# EAGLE design PCB (EAGLE 9.2.2)

## Sheet 1 of 2
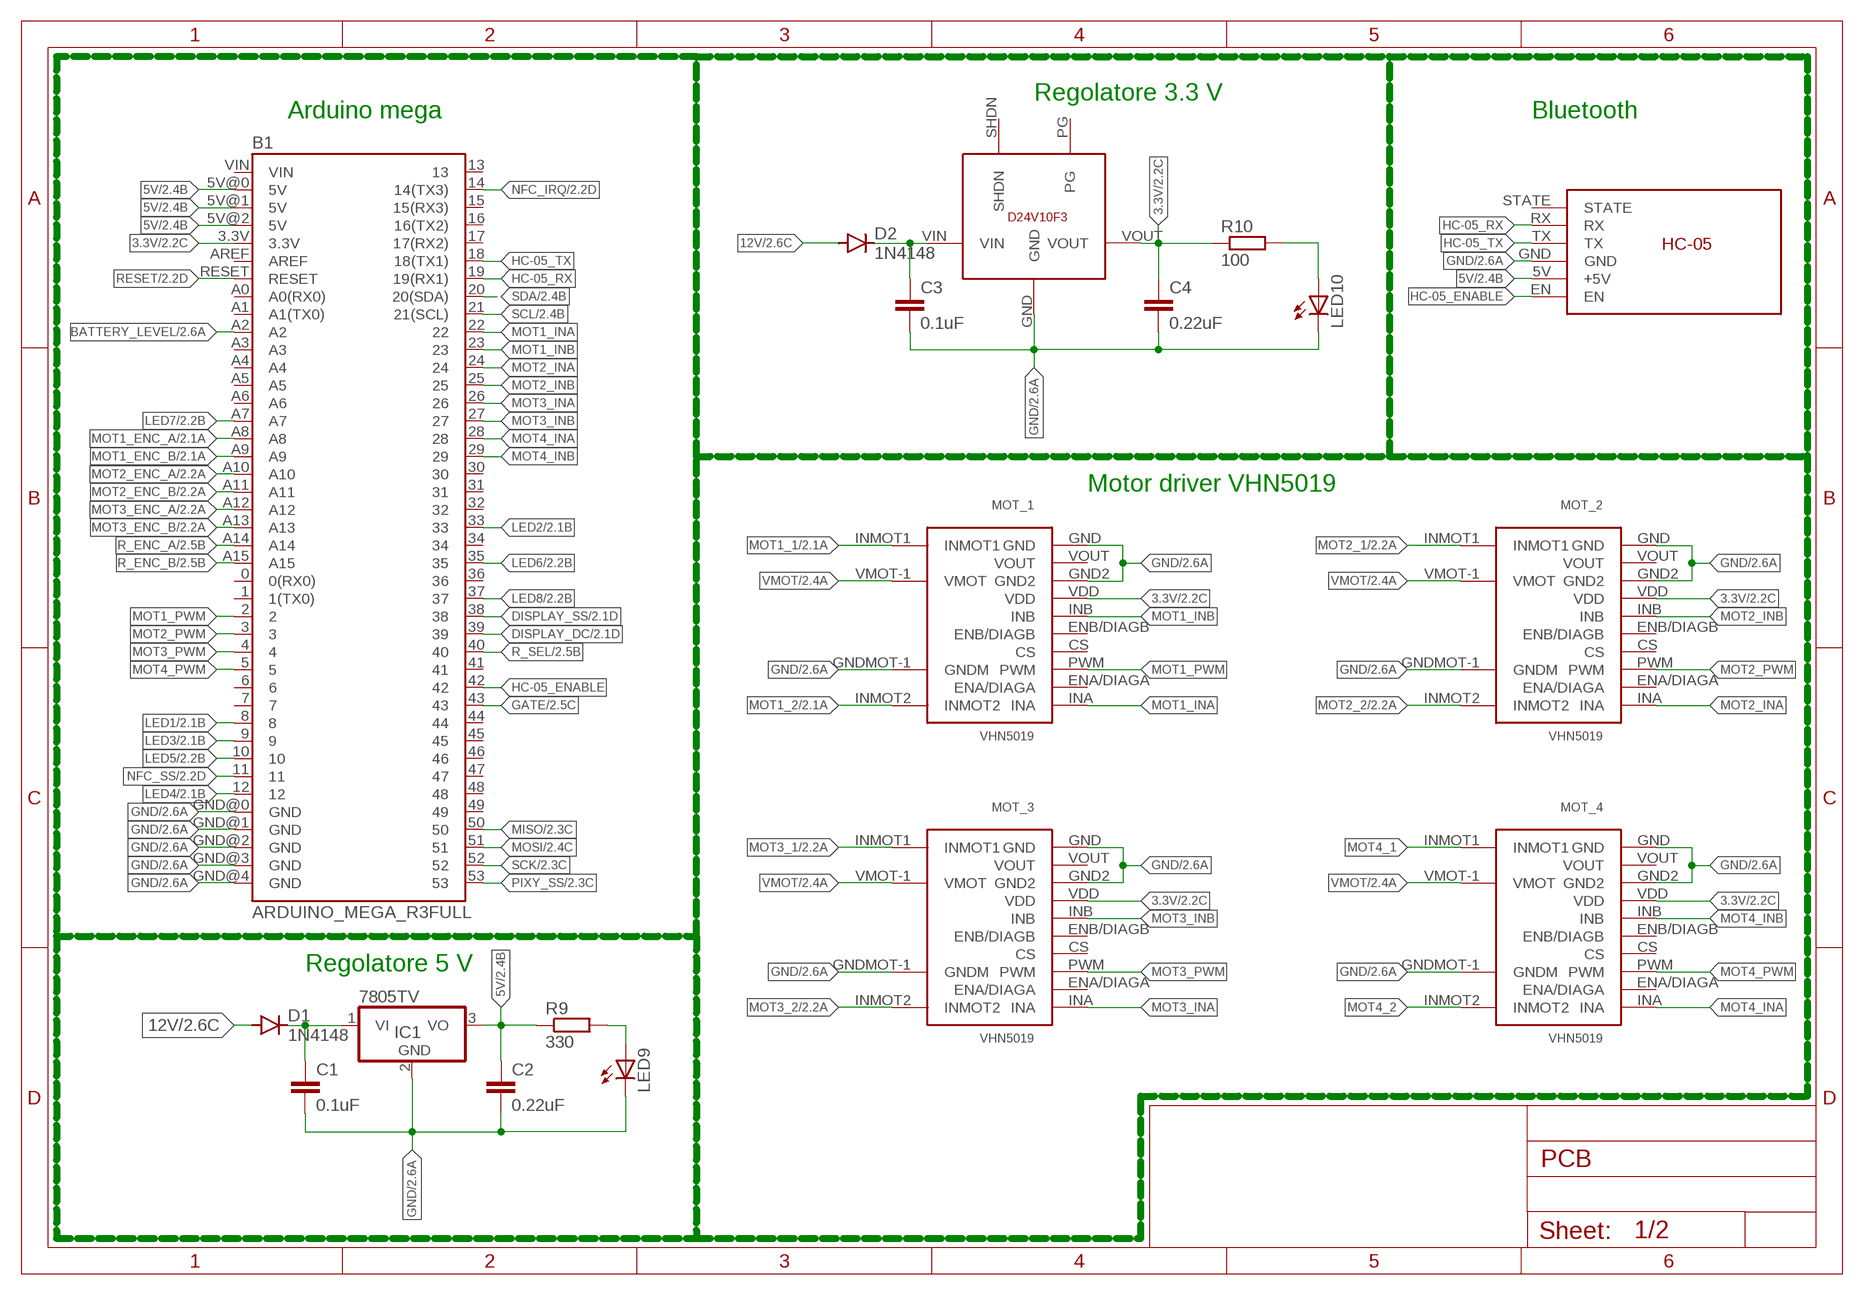
[diagram p0: schematic, sheet 1]

### Parts
B1  ARDUINO_MEGA_R3FULL  [ARDUINO_MEGA]
C1  0.1uF  0.1UF-KIT-EZ-50V-20%  [CAP-PTH-SMALL-KIT]
C2  0.22uF  0.1UF-KIT-EZ-50V-20%  [CAP-PTH-SMALL-KIT]
C3  0.1uF  0.1UF-KIT-EZ-50V-20%  [CAP-PTH-SMALL-KIT]
C4  0.22uF  0.1UF-KIT-EZ-50V-20%  [CAP-PTH-SMALL-KIT]
D1  1N4148  1N4942  [DO41-10]
D2  1N4148  1N4942  [DO41-10]
IC1  7805TV  [TO220V]
LED9  LED1206  [LED-1206]
LED10  LED1206  [LED-1206]
MOT_1  VHN5019  [MOTOR-SHIELD]
MOT_2  VHN5019  [MOTOR-SHIELD]
MOT_3  VHN5019  [MOTOR-SHIELD]
MOT_4  VHN5019  [MOTOR-SHIELD]
R9  330  RR1206  [R1206]
R10  100  RR1206  [R1206]
U$1  STEPDOWN_D24V10F3  [STEPDOWN_D24V10F3]
U$9  HC-05  [HC-05]

### Nets
3.3V: B1.3.3V C4.1 MOT_1.VDD MOT_2.VDD MOT_3.VDD MOT_4.VDD R10.1 U$1.VOUT ; also sheet 2
5V: B1.5V@0(5V) B1.5V@1(5V) B1.5V@2(5V) C2.1 IC1.3(VO) R9.1 U$9.5V(+5V) ; also sheet 2
12V: D1.A D2.A ; also sheet 2
BATTERY_LEVEL: B1.A2 ; also sheet 2
DISPLAY_DC: B1.39 ; also sheet 2
DISPLAY_SS: B1.38 ; also sheet 2
GATE: B1.43 ; also sheet 2
GND: B1.GND@0(GND) B1.GND@1(GND) B1.GND@2(GND) B1.GND@3(GND) B1.GND@4(GND) C1.2 C2.2 C3.2 C4.2 IC1.2(GND) LED9.C LED10.C MOT_1.GND MOT_1.GND2 MOT_1.GNDMOT-1(GNDM) MOT_2.GND MOT_2.GND2 MOT_2.GNDMOT-1(GNDM) MOT_3.GND MOT_3.GND2 MOT_3.GNDMOT-1(GNDM) MOT_4.GND MOT_4.GND2 MOT_4.GNDMOT-1(GNDM) U$1.GND U$9.GND ; also sheet 2
HC-05_ENABLE: B1.42 U$9.EN
HC-05_RX: B1.19(19(RX1)) U$9.RX
HC-05_TX: B1.18(18(TX1)) U$9.TX
LED1: B1.8 ; also sheet 2
LED2: B1.33 ; also sheet 2
LED3: B1.9 ; also sheet 2
LED4: B1.12 ; also sheet 2
LED5: B1.10 ; also sheet 2
LED6: B1.35 ; also sheet 2
LED7: B1.A7 ; also sheet 2
LED8: B1.37 ; also sheet 2
MISO: B1.50 ; also sheet 2
MOSI: B1.51 ; also sheet 2
MOT1_1: MOT_1.INMOT1 ; also sheet 2
MOT1_2: MOT_1.INMOT2 ; also sheet 2
MOT1_ENC_A: B1.A8 ; also sheet 2
MOT1_ENC_B: B1.A9 ; also sheet 2
MOT1_INA: B1.22 MOT_1.INA
MOT1_INB: B1.23 MOT_1.INB
MOT1_PWM: B1.2 MOT_1.PWM
MOT2_1: MOT_2.INMOT1 ; also sheet 2
MOT2_2: MOT_2.INMOT2 ; also sheet 2
MOT2_ENC_A: B1.A10 ; also sheet 2
MOT2_ENC_B: B1.A11 ; also sheet 2
MOT2_INA: B1.24 MOT_2.INA
MOT2_INB: B1.25 MOT_2.INB
MOT2_PWM: B1.3 MOT_2.PWM
MOT3_1: MOT_3.INMOT1 ; also sheet 2
MOT3_2: MOT_3.INMOT2 ; also sheet 2
MOT3_ENC_A: B1.A12 ; also sheet 2
MOT3_ENC_B: B1.A13 ; also sheet 2
MOT3_INA: B1.26 MOT_3.INA
MOT3_INB: B1.27 MOT_3.INB
MOT3_PWM: B1.4 MOT_3.PWM
MOT4_1: MOT_4.INMOT1
MOT4_2: MOT_4.INMOT2
MOT4_INA: B1.28 MOT_4.INA
MOT4_INB: B1.29 MOT_4.INB
MOT4_PWM: B1.5 MOT_4.PWM
N$3: LED9.A R9.2
N$4: C3.1 D2.C U$1.VIN
N$6: LED10.A R10.2
N$8: C1.1 D1.C IC1.1(VI)
NFC_IRQ: B1.14(14(TX3)) ; also sheet 2
NFC_SS: B1.11 ; also sheet 2
PIXY_SS: B1.53 ; also sheet 2
R_ENC_A: B1.A14 ; also sheet 2
R_ENC_B: B1.A15 ; also sheet 2
R_SEL: B1.40 ; also sheet 2
RESET: B1.RESET ; also sheet 2
SCK: B1.52 ; also sheet 2
SCL: B1.21(21(SCL)) ; also sheet 2
SDA: B1.20(20(SDA)) ; also sheet 2
VMOT: MOT_1.VMOT-1(VMOT) MOT_2.VMOT-1(VMOT) MOT_3.VMOT-1(VMOT) MOT_4.VMOT-1(VMOT) ; also sheet 2
Unconnected: B1.0(0(RX0)) B1.1(1(TX0)) B1.6 B1.7 B1.13 B1.15(15(RX3)) B1.16(16(TX2)) B1.17(17(RX2)) B1.30 B1.31 B1.32 B1.34 B1.36 B1.41 B1.44 B1.45 B1.46 B1.47 B1.48 B1.49 B1.A0(A0(RX0)) B1.A1(A1(TX0)) B1.A3 B1.A4 B1.A5 B1.A6 B1.AREF B1.VIN MOT_1.CS MOT_1.ENA/DIAGA MOT_1.ENB/DIAGB MOT_1.VOUT MOT_2.CS MOT_2.ENA/DIAGA MOT_2.ENB/DIAGB MOT_2.VOUT MOT_3.CS MOT_3.ENA/DIAGA MOT_3.ENB/DIAGB MOT_3.VOUT MOT_4.CS MOT_4.ENA/DIAGA MOT_4.ENB/DIAGB MOT_4.VOUT U$1.PG U$1.SHDN U$9.STATE

### Notes on the sheet
- Regolatore 3.3 V
- Arduino mega | Bluetooth
- Motor driver VHN5019
- Regolatore 5 V

## Sheet 2 of 2
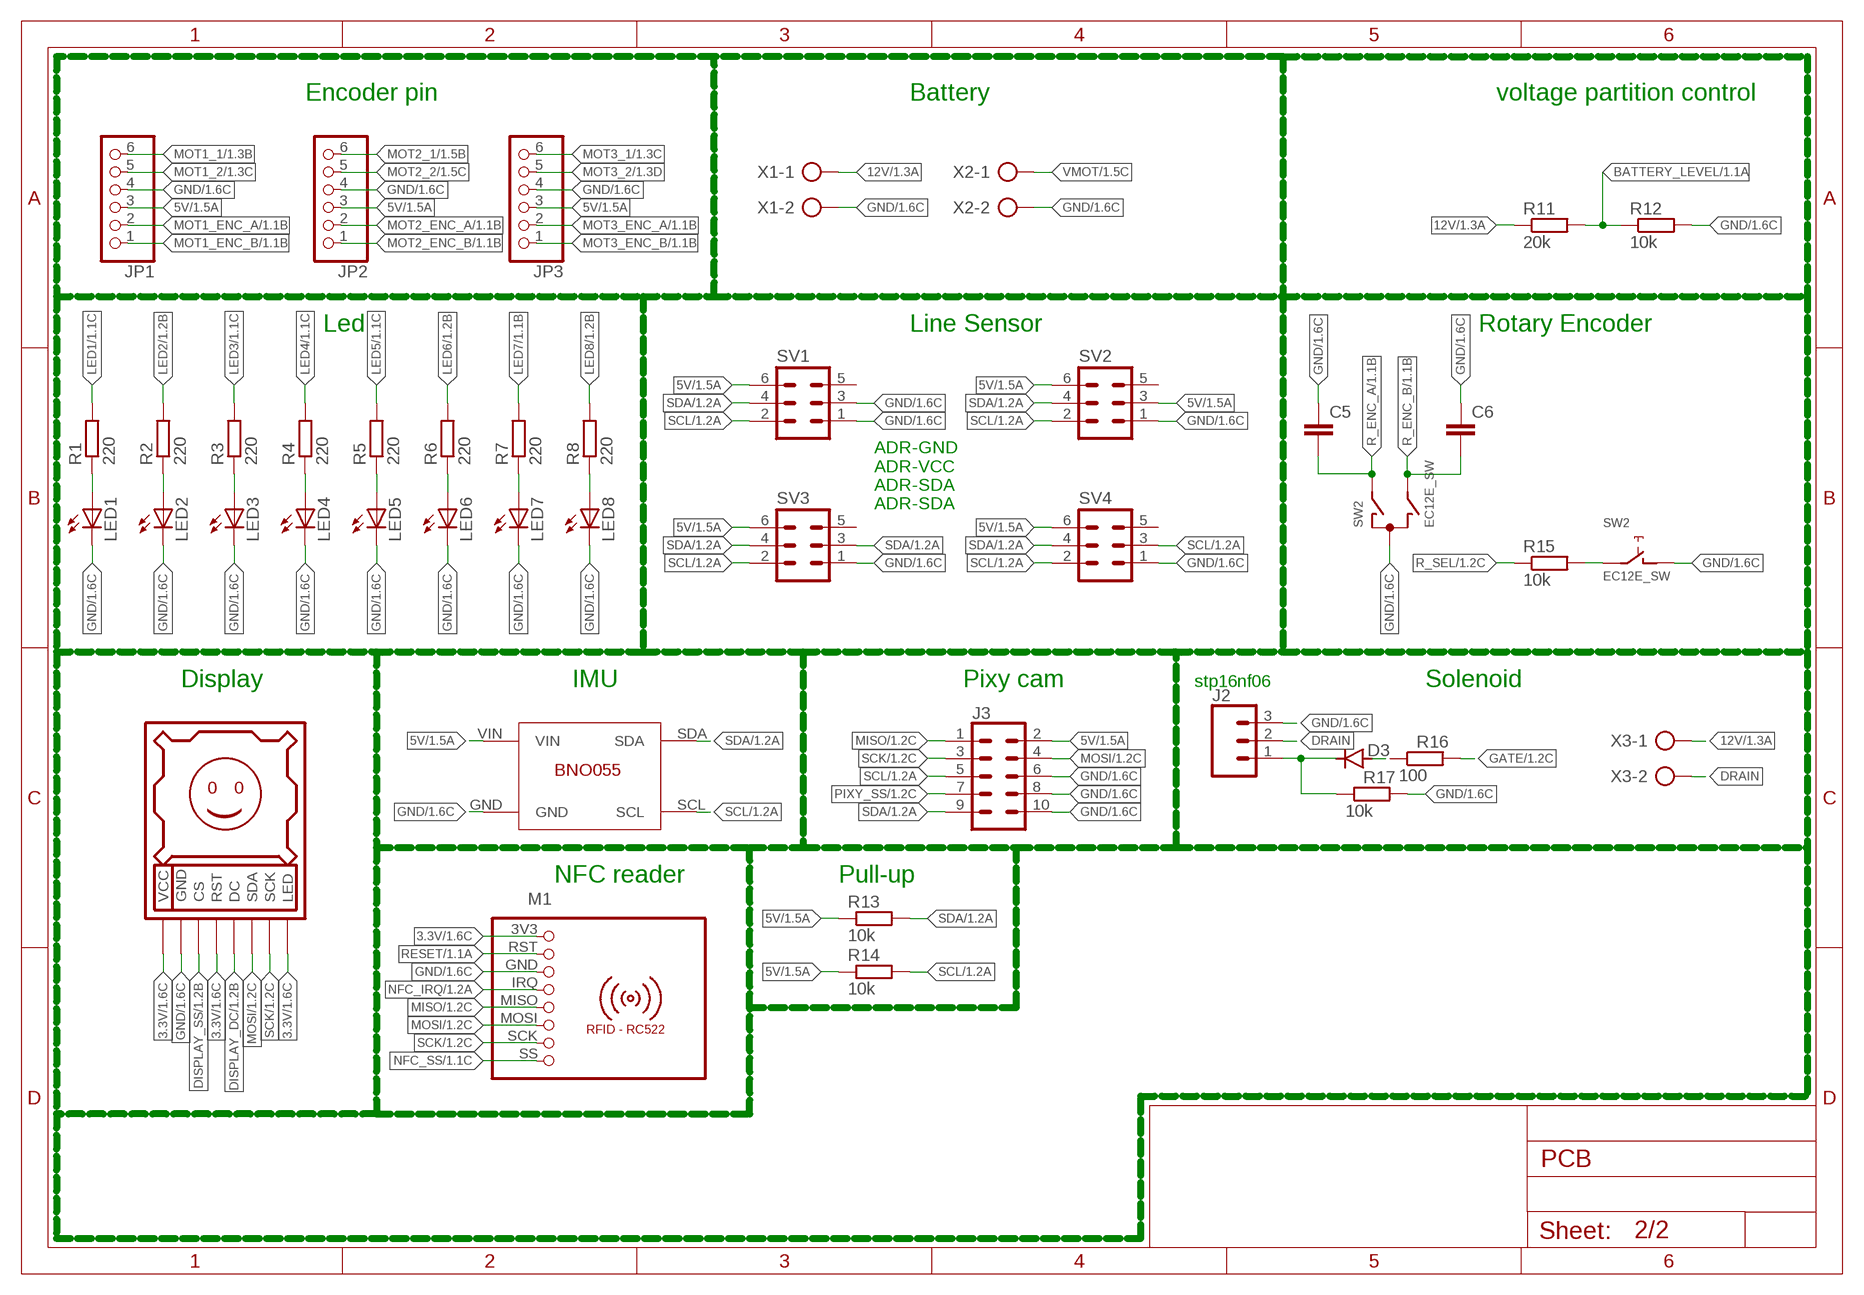
[diagram p1: schematic, sheet 2]

### Parts
C5  C-EUC1206  [C1206]
C6  C-EUC1206  [C1206]
D3  1N4148  1N4148DO35-7  [DO35-7]
DISPLAY1  DISPLAY128X128  [DISPLAY128X128]
J2  455-1750-1-ND  CONN_03  [1X03]
J3  CONN_05X2PTH  [2X5]
JP1  PINHD-1X6  [1X06]
JP2  PINHD-1X6  [1X06]
JP3  PINHD-1X6  [1X06]
LED1  LED1206  [LED-1206]
LED2  LED1206  [LED-1206]
LED3  LED1206  [LED-1206]
LED4  LED1206  [LED-1206]
LED5  LED1206  [LED-1206]
LED6  LED1206  [LED-1206]
LED7  LED1206  [LED-1206]
LED8  LED1206  [LED-1206]
M1  RFID-RC522  [RFID-RC522]
R1  220  RR1206  [R1206]
R2  220  RR1206  [R1206]
R3  220  RR1206  [R1206]
R4  220  RR1206  [R1206]
R5  220  RR1206  [R1206]
R6  220  RR1206  [R1206]
R7  220  RR1206  [R1206]
R8  220  RR1206  [R1206]
R11  20k  R0204/7  [0204/7]
R12  10k  R0204/7  [0204/7]
R13  10k  RR1206  [R1206]
R14  10k  RR1206  [R1206]
R15  10k  RR1206  [R1206]
R16  100  RR1206  [R1206]
R17  10k  RR1206  [R1206]
SV1  MA03-2  [MA03-2]
SV2  MA03-2  [MA03-2]
SV3  MA03-2  [MA03-2]
SV4  MA03-2  [MA03-2]
SW2  EC12E_SW  [ALPS_EC12E_SW]
U$8  BNO055  [BNO005]
X1  AK500/2-H  [AK500/2-H]
X2  AK500/2-H  [AK500/2-H]
X3  AK500/2-H  [AK500/2-H]

### Nets
3.3V: DISPLAY1.LED DISPLAY1.RST DISPLAY1.VCC M1.3V3 ; also sheet 1
5V: J3.2 JP1.3 JP2.3 JP3.3 R13.1 R14.1 SV1.6 SV2.3 SV2.6 SV3.6 SV4.6 U$8.VIN ; also sheet 1
12V: R11.1 X1.1 X3.1 ; also sheet 1
BATTERY_LEVEL: R11.2 R12.1 ; also sheet 1
DISPLAY_DC: DISPLAY1.DC ; also sheet 1
DISPLAY_SS: DISPLAY1.CS ; also sheet 1
DRAIN: J2.2 X3.2
GATE: R16.2 ; also sheet 1
GND: C5.1 C6.1 DISPLAY1.GND J2.3 J3.6 J3.8 J3.10 JP1.4 JP2.4 JP3.4 LED1.C LED2.C LED3.C LED4.C LED5.C LED6.C LED7.C LED8.C M1.GND R12.2 R17.2 SV1.1 SV1.3 SV2.1 SV3.1 SV4.1 SW2.C SW2.D U$8.GND X1.2 X2.2 ; also sheet 1
LED1: R1.2 ; also sheet 1
LED2: R2.2 ; also sheet 1
LED3: R3.2 ; also sheet 1
LED4: R4.2 ; also sheet 1
LED5: R5.2 ; also sheet 1
LED6: R6.2 ; also sheet 1
LED7: R7.2 ; also sheet 1
LED8: R8.2 ; also sheet 1
MISO: J3.1 M1.MISO ; also sheet 1
MOSI: DISPLAY1.SDA J3.4 M1.MOSI ; also sheet 1
MOT1_1: JP1.6 ; also sheet 1
MOT1_2: JP1.5 ; also sheet 1
MOT1_ENC_A: JP1.2 ; also sheet 1
MOT1_ENC_B: JP1.1 ; also sheet 1
MOT2_1: JP2.6 ; also sheet 1
MOT2_2: JP2.5 ; also sheet 1
MOT2_ENC_A: JP2.2 ; also sheet 1
MOT2_ENC_B: JP2.1 ; also sheet 1
MOT3_1: JP3.6 ; also sheet 1
MOT3_2: JP3.5 ; also sheet 1
MOT3_ENC_A: JP3.2 ; also sheet 1
MOT3_ENC_B: JP3.1 ; also sheet 1
N$5: D3.C J2.1 R17.1
N$7: D3.A R16.1
N$10: LED1.A R1.1
N$12: LED2.A R2.1
N$13: LED3.A R3.1
N$14: LED4.A R4.1
N$17: LED5.A R5.1
N$18: LED6.A R6.1
N$23: LED7.A R7.1
N$24: LED8.A R8.1
N$25: R15.2 SW2.E
NFC_IRQ: M1.IRQ ; also sheet 1
NFC_SS: M1.SS ; also sheet 1
PIXY_SS: J3.7 ; also sheet 1
R_ENC_A: C5.2 SW2.A ; also sheet 1
R_ENC_B: C6.2 SW2.B ; also sheet 1
R_SEL: R15.1 ; also sheet 1
RESET: M1.RST ; also sheet 1
SCK: DISPLAY1.SCK J3.3 M1.SCK ; also sheet 1
SCL: J3.5 R14.2 SV1.2 SV2.2 SV3.2 SV4.2 SV4.3 U$8.SCL ; also sheet 1
SDA: J3.9 R13.2 SV1.4 SV2.4 SV3.3 SV3.4 SV4.4 U$8.SDA ; also sheet 1
VMOT: X2.1 ; also sheet 1
Unconnected: SV1.5 SV2.5 SV3.5 SV4.5 SW2.GND1(G) SW2.GND2(G)

### Notes on the sheet
- Encoder pin | Battery | voltage partition control
- Led | Line Sensor | Rotary Encoder
- ADR-GND
  ADR-VCC
  ADR-SDA
  ADR-SDA
- Display | IMU | Pixy cam | stp16nf06 | Solenoid
- NFC reader | Pull-up

## Library data of the parts
B1 = SparkFun-Boards:ARDUINO_MEGA_R3: Arduino Mega R3 ATmega2560 R3 compatible footprint. SparkFun Products: Arduino Mega 2560 R3 <https://www.sparkfun.com/products/11061>
C1 C3 = SparkFun-Capacitors:0.1UF: 0.1µF ceramic capacitors A capacitor is a passive two-terminal electrical component used to store electrical energy temporarily in an electric field.; PROD_ID: CAP-08370
C2 C4 = SparkFun-Capacitors:0.1UF: 0.1µF ceramic capacitors A capacitor is a passive two-terminal electrical component used to store electrical energy temporarily in an electric field.; PROD_ID: CAP-08370; VALUE: 0.1uF
C5 C6 = rcl:C-EU: CAPACITOR, European symbol; SPICEPREFIX: C
D1 D2 = diode:1N4942: DIODE 1.0 A, 200 V, 150 ns
D3 = diode:1N4148: DIODE high speed (Philips)
DISPLAY1 = Display 128x128:DISPLAY128X128: LCD 1.44" Red Serial 128X128 SPI Color TFT LCD Display Module for Nokia 15XX Product information Description： 100% brand new and high quality 1.44-inch screen with SPI serial backplane module, a minimum of only four IO-driven resolution 128 * 128 Spike NOKIA 15XX, perfect upgrade true color Size: 1.44 inch SPI serial bus Resolution 128 * 128 Package Include:
IC1 = linear:78*: Positive VOLTAGE REGULATOR Source: http://cache.national.com/ds/LM/LM78L05.pdf http://www.fairchildsemi.com/ds/LM/LM7805.pdf
J2 = SparkFun-Connectors:CONN_03: Multi connection point. Often used as Generic Header-pin footprint for 0.1 inch spaced/style header connections On any of the 0.1 inch spaced packages, you can populate with these: Break Away Headers - Straight <https://www.sparkfun.com/products/116> (PRT-00116) Break Away Male Headers - Right Angle <https://www.sparkfun.com/products/553> (PRT-00553) Female Headers <https://www.sparkfun.com/products/115> (PRT-00115) Break Away Headers - Machine Pin <https://www.sparkfun.com/products/117> (PRT-00117) Break Away Female Headers - Swiss Machine Pin <https://www.sparkfun.com/products/743> (PRT-00743) Stackable Header - 3 Pin (Female, 0.1") <https://www.sparkfun.com/products/13875> (PRT-13875) For SCREWTERMINALS and SPRING TERMINALS visit here: Screw Terimnals on SparkFun.com <https://www.sparkfun.com/search/results?term=Screw+Terminals> (5mm/3.5mm/2.54mm spacing) This device is also useful as a general connection point to wire up your design to another part of your project. Our various solder wires solder well into these plated through hole pads. Hook-Up Wire - Assortment (Stranded, 22 AWG) <https://www.sparkfun.com/products/11375> (PRT-11375) Hook-Up Wire - Assortment (Solid Core, 22 AWG) <https://www.sparkfun.com/products/11367> (PRT-11367) View the entire wire category on our website here <https://www.sparkfun.com/categories/141> Special notes: Molex polarized connector foot print use with SKU : PRT-08232 with associated crimp pins and housings.; PROD_ID: XXX-00000
J3 = SparkFun-Connectors:CONN_05X2: Multi connection point. Often used as Generic Header-pin footprint for 0.1 inch spaced/style header connections For AVR SPI programming port, see special device with nice symbol: "AVR_SPI_PROG_5x2.dev" You can populate with any combo of single row headers, but if you'd like an exact match, check these: 2x5 AVR ICSP Male Header <https://www.sparkfun.com/products/778> (PRT-00778) 2x5 Pin Shrouded Header <https://www.sparkfun.com/products/8506> (PRT-08506) On any of the 0.1 inch spaced packages, you can populate with these: Break Away Headers - Straight <https://www.sparkfun.com/products/116> (PRT-00116) Break Away Male Headers - Right Angle <https://www.sparkfun.com/products/553> (PRT-00553) Female Headers <https://www.sparkfun.com/products/115> (PRT-00115) Break Away Headers - Machine Pin <https://www.sparkfun.com/products/117> (PRT-00117) Break Away Female Headers - Swiss Machine Pin <https://www.sparkfun.com/products/743> (PRT-00743) Special note: the shrouded connector mates well with our 5x2 ribbon cables: 2x5 Pin IDC Ribbon Cable <https://www.sparkfun.com/products/8535> (PRT-08535); PROD_ID: CONN-08499; SF_ID: PRT-0778
JP1-JP3 = pinhead:PINHD-1X6: PIN HEADER
LED1-LED10 = SparkFun-Retired:LED: LEDs Standard schematic elements and footprints for 5mm, 3mm, 1206, and 0603 sized LEDs. 5mm - Spark Fun Electronics SKU : Comp-SBL
M1 = mfrc522-module:RFID-RC522: RFID-RC522 MFRC-522 based breakout board
MOT_1-MOT_4 = VHN5019:VHN5019: Operating voltage: 5.5 – 24 V1 Output current: 12 A continuous (30 maximum) 3V-compatible inputs PWM operation up to 20 kHz, which is ultrasonic and allows for quieter motor operation Current sense output proportional to motor current (approx. 140 mV/A) Motor indicator LEDs (indicates what the outputs are doing even when no motor is connected) Robust: Reverse-voltage protection Can survive input voltages up to 41 V Undervoltage and overvoltage shutdown High-side and low-side thermal shutdown Short-to-ground and short-to-Vcc protection; MOTOR: motor
R1-R17 = eagle-ltspice:R: RESISTOR, European symbol; SPICEMODEL: NONE; SPICEPREFIX: R
SV1-SV4 = con-lstb:MA03-2: PIN HEADER; OC_FARNELL: unknown; OC_NEWARK: unknown
SW2 = switch-alps:EC12E_SW: ALPS rotary Encoder EC12E series with switch; MPN: EC12E2424407; OC_FARNELL: 1520813; OC_NEWARK: 74M1068
U$1 = StepDown_ 3.3V_D24V10F3:STEPDOWN_D24V10F3: Step down pololu D24V10F3 da 12 V a 3.3V
U$8 = BNO055:BNO055: BNO055
U$9 = HC-05:HC-05
X1-X3 = con-ptr500:AK500/2-H: CONNECTOR Aug. 2004 / PTR Meßtechnik: Die Bezeichnung der Serie AK505 wurde geändert. Es handelt sich hierbei um AK500 in horizontaler Ausführung.; OC_FARNELL: unknown; OC_NEWARK: unknown

## Board
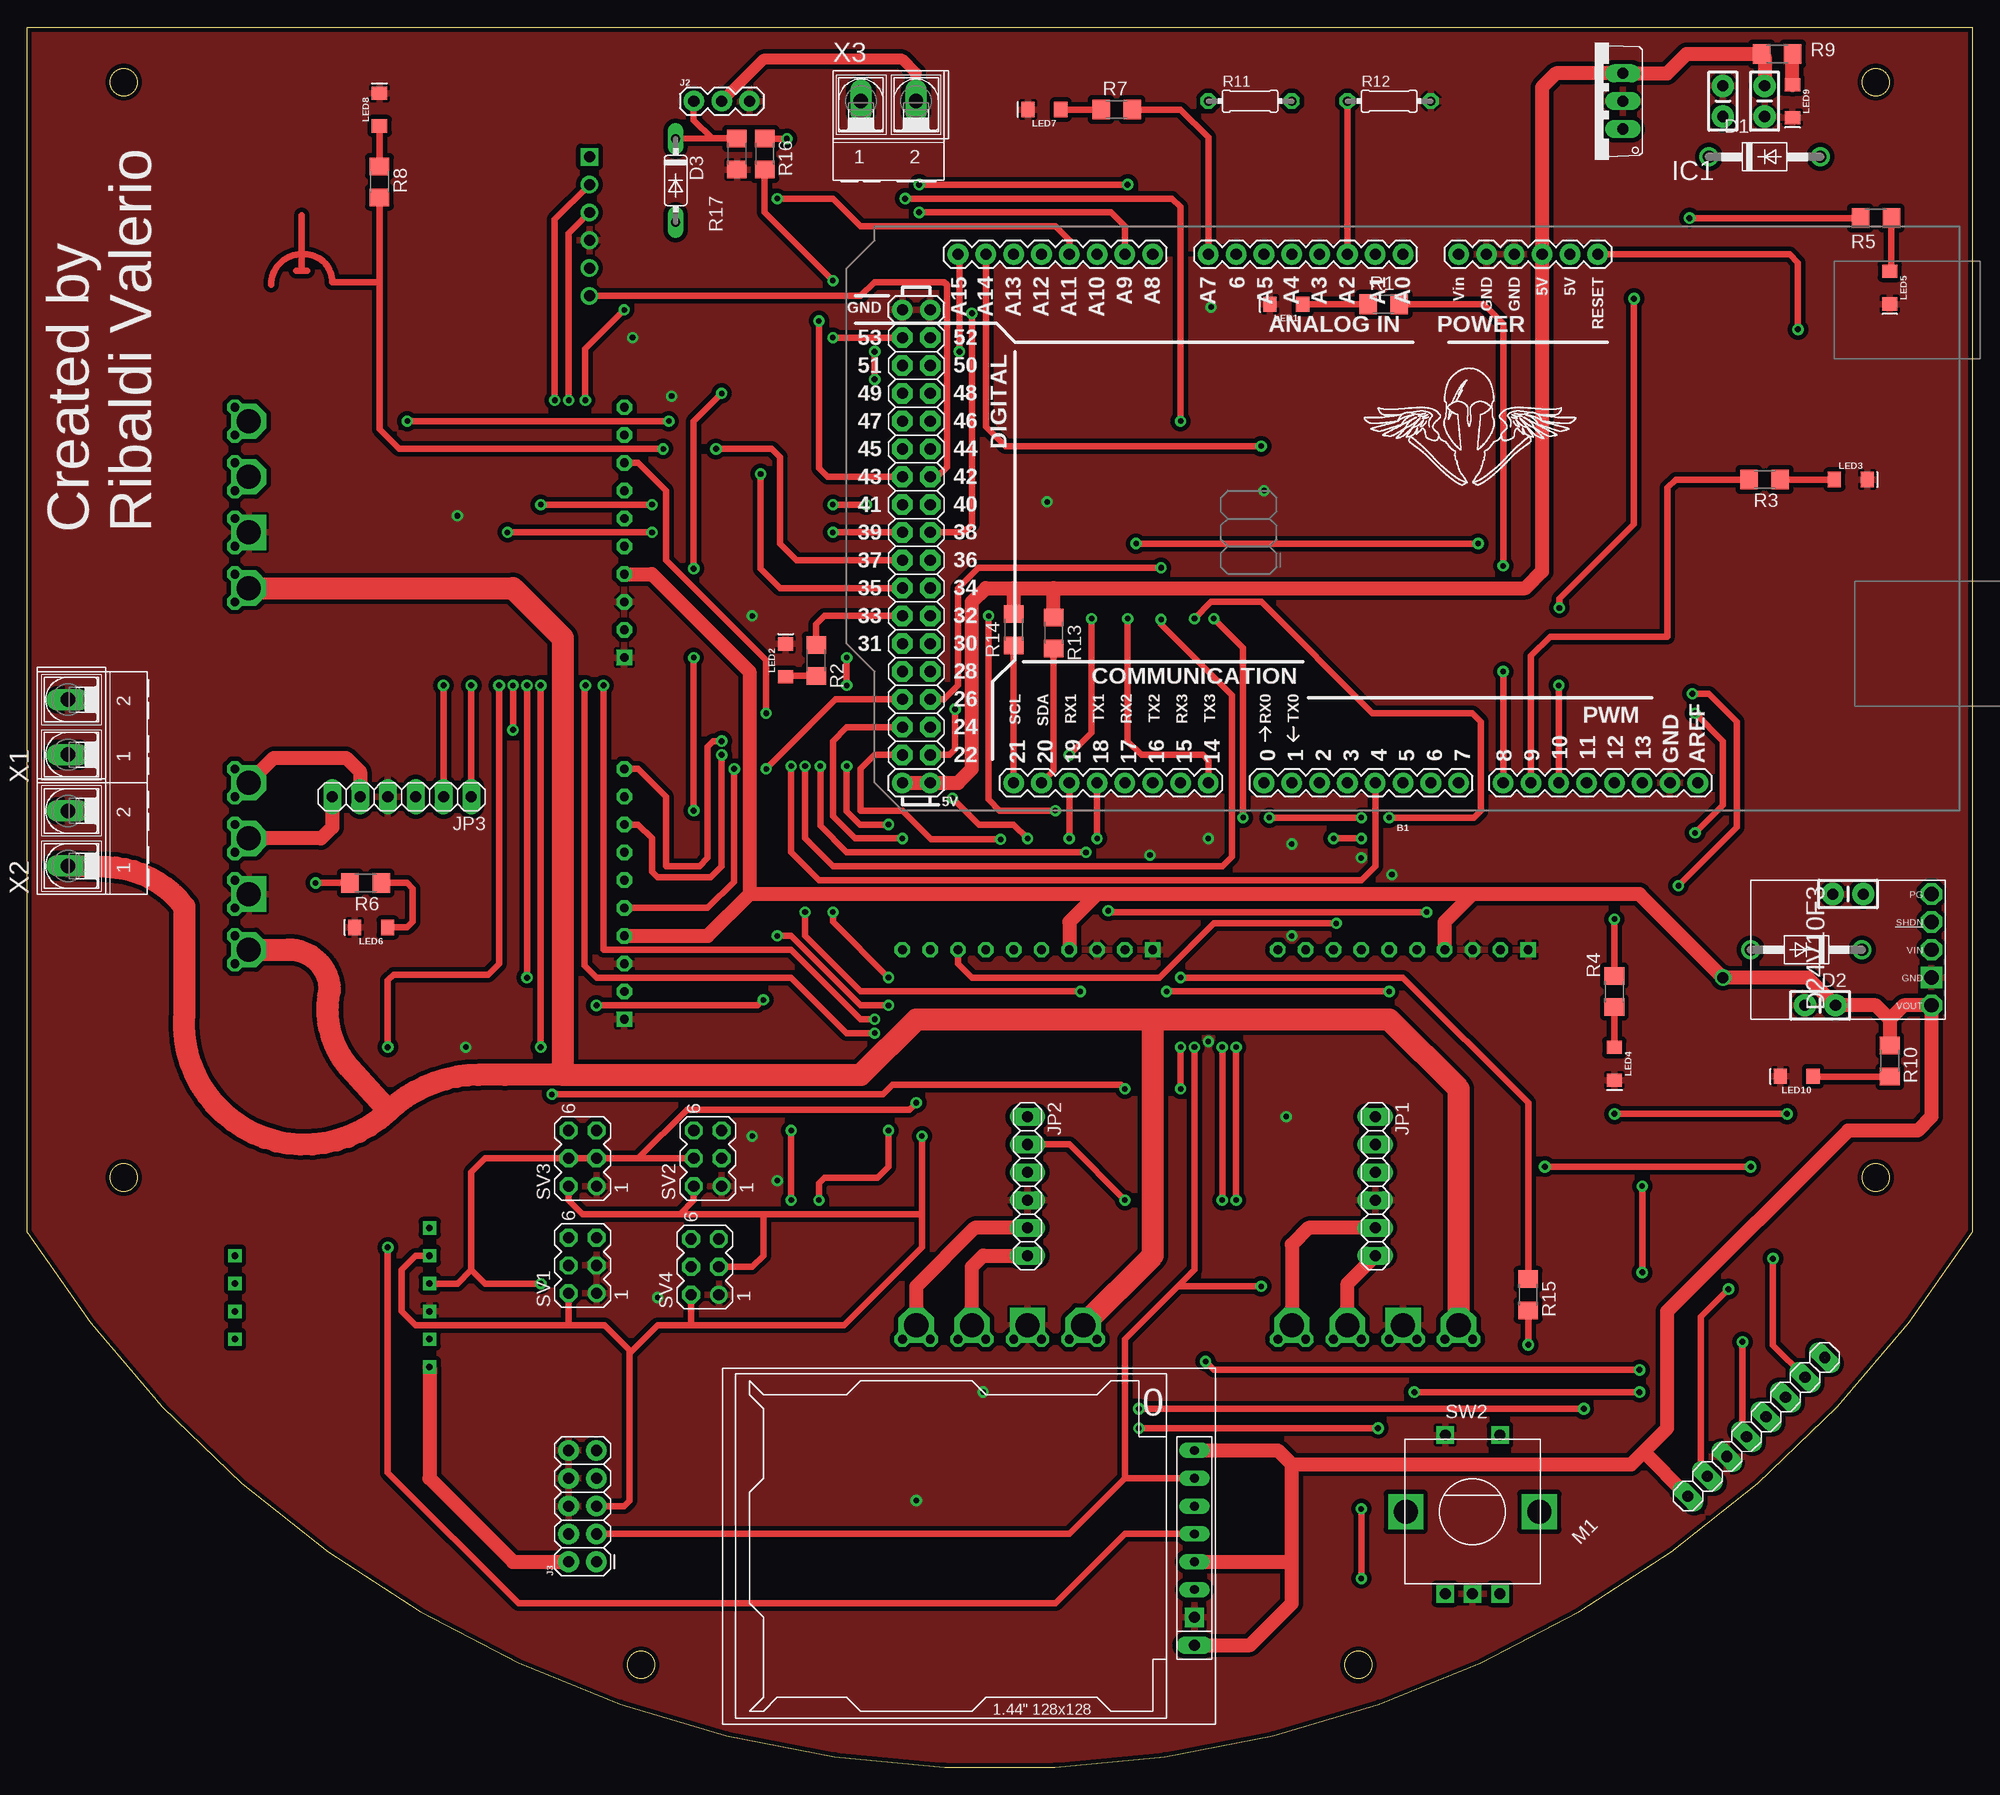
[diagram p2: board, top side]
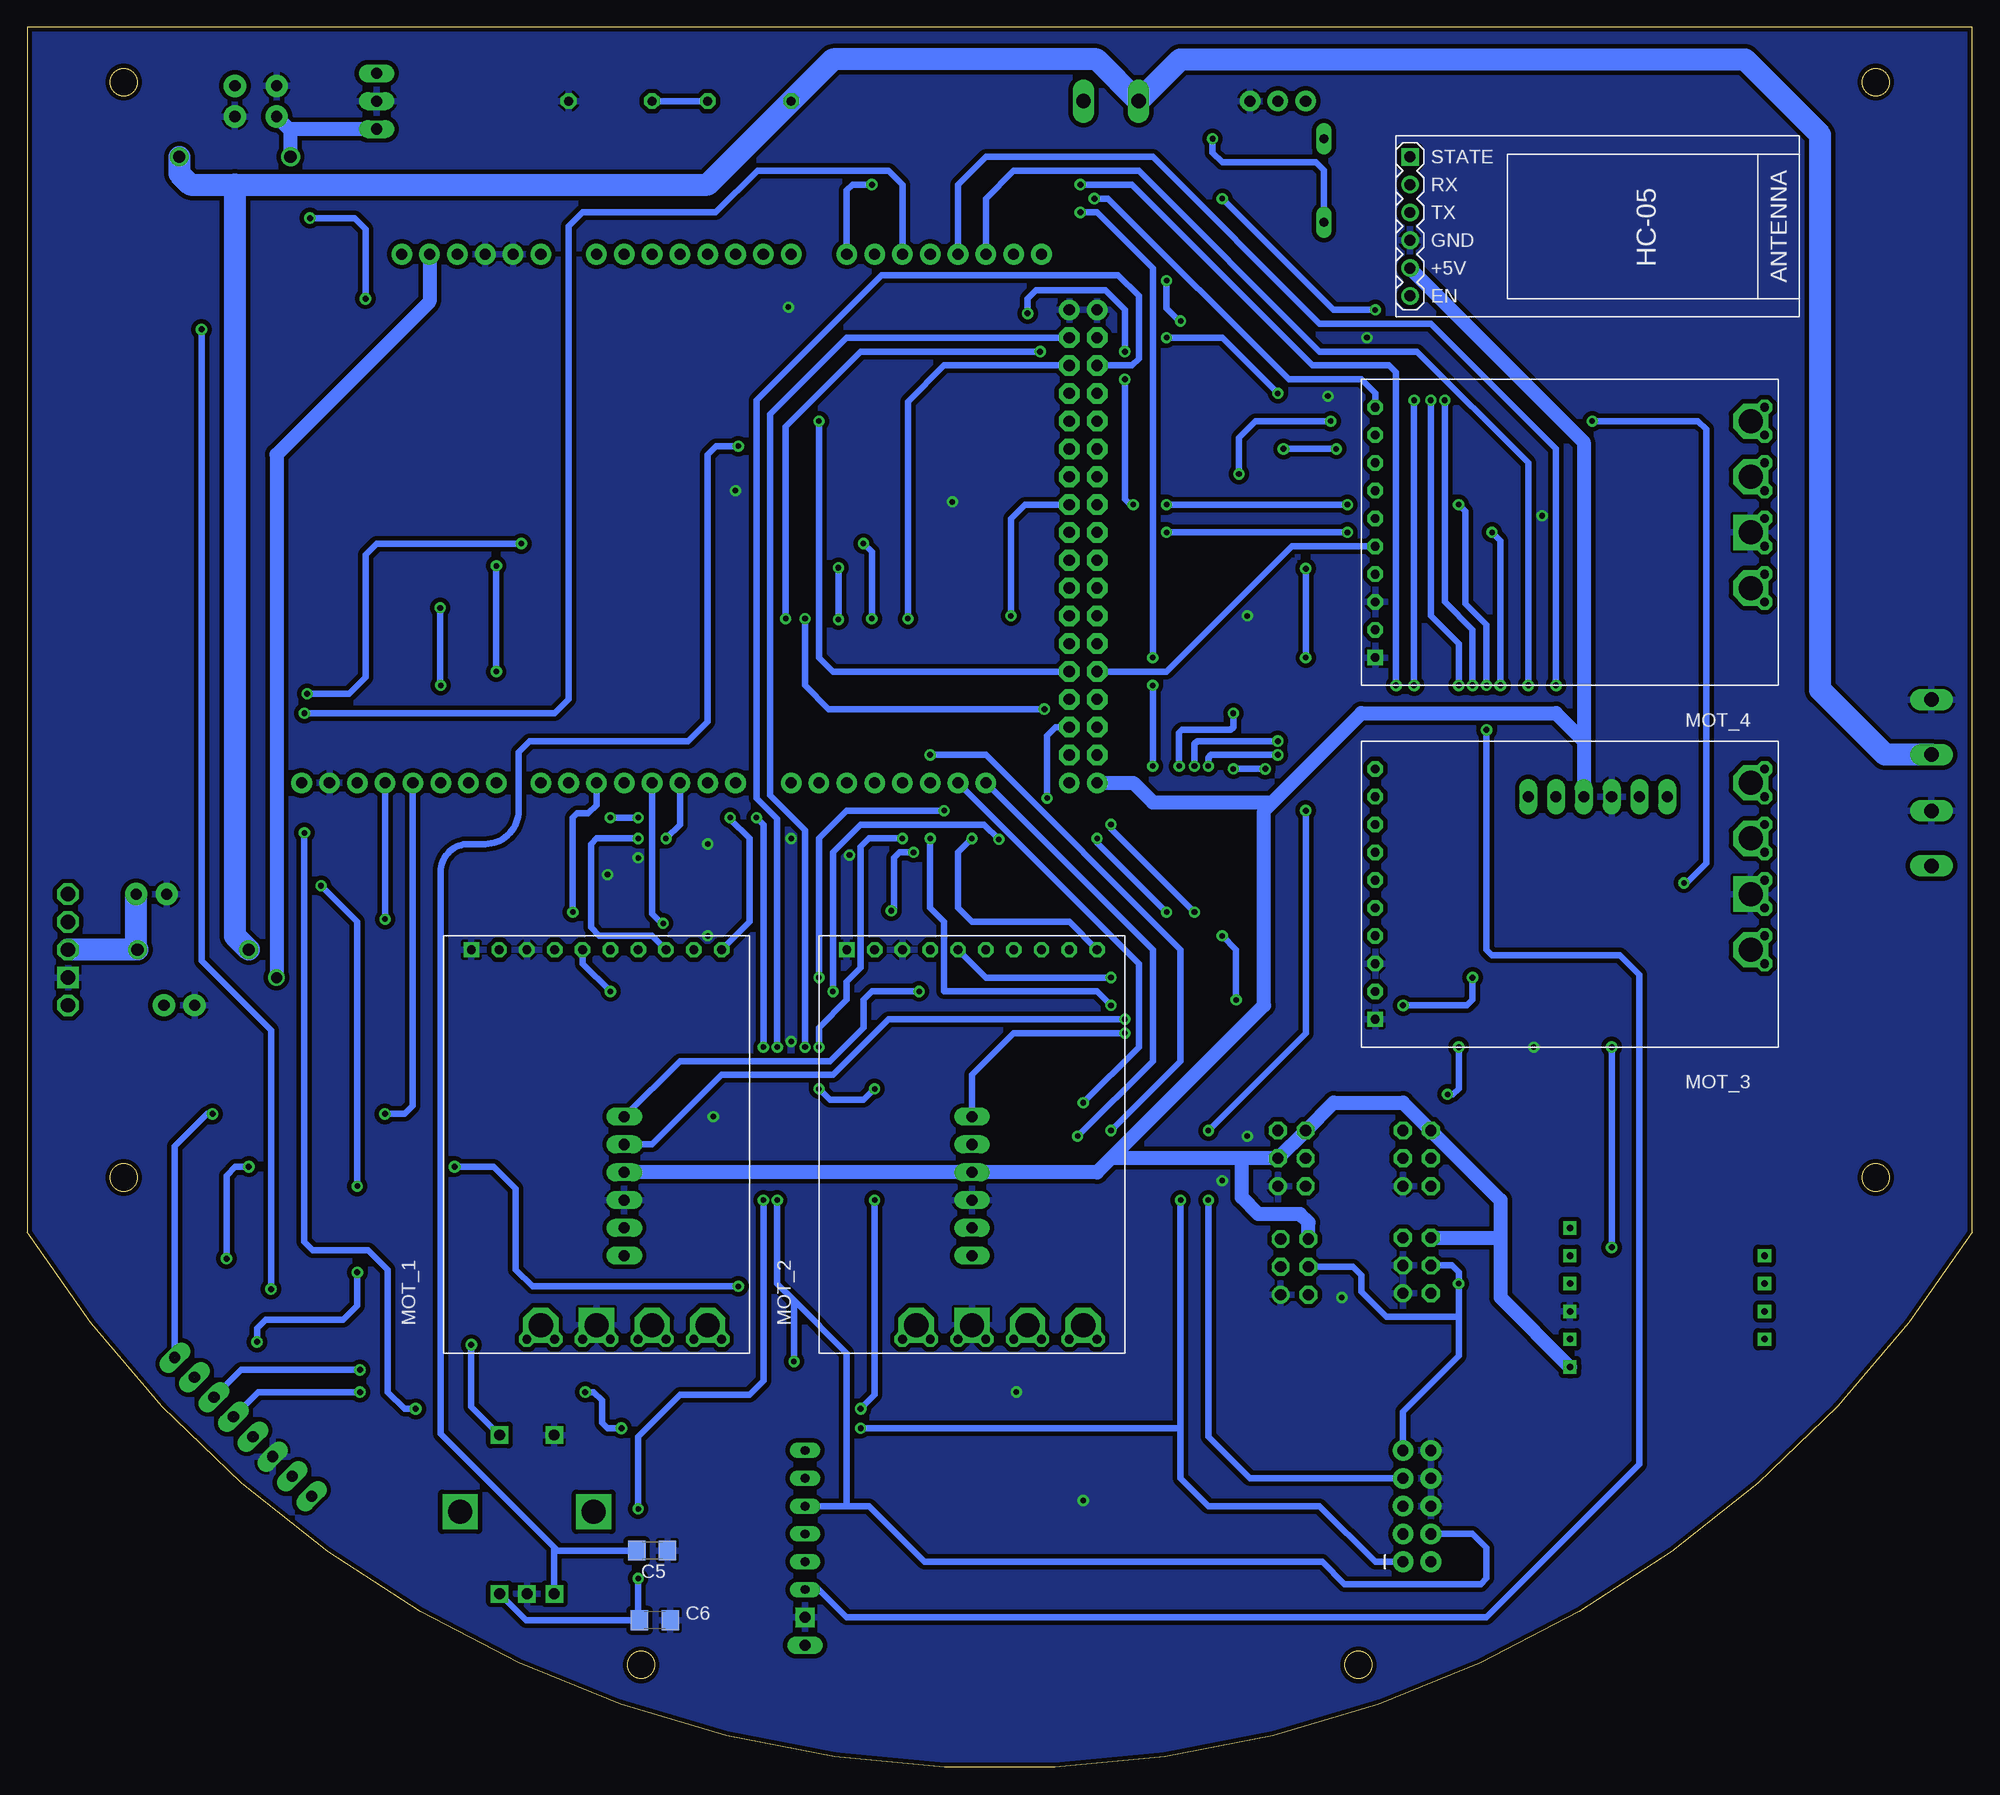
[diagram p3: board, bottom side, seen from below]

Size 177.6 x 158.85 mm. Coordinates in mm from the lower left corner, seen from the top.
Outline: 0,158.85 177.6,158.85 177.6,48.85 arc-115 0,48.85 0,158.85
Outline: circle at 8.8,53.85 radius 1.25
Outline: circle at 168.8,53.85 radius 1.25
Outline: circle at 168.8,153.85 radius 1.25
Outline: circle at 8.8,153.85 radius 1.25
Outline: circle at 121.56,9.34 radius 1.25
Outline: circle at 56.04,9.34 radius 1.25
Copper layers (1*16): Top 0.035mm / dielectric 1.5mm / Bottom 0.035mm
Design rules "SparkFun": minimum track width 8mil, minimum drill 20mil, track to track 8mil, track to pad 8mil, pad to pad 8mil, via to via 8mil, smd to smd 8mil, copper to edge 10mil, drill to drill 8mil, minimum pad ring 12mil, minimum via ring 10mil, stop-mask expansion 4mil, vias tented up to drill 25mil, thermal gap 10mil

### Footprints (pad centres in the part's own frame; a part is rotated, then mirrored left to right if it is on the bottom)
ARDUINO_MEGA = drill 1.016 pad 1.88: 0 13.97,24.13; 1 11.43,24.13; 2 8.89,24.13; 3 6.35,24.13; 3.3V -13.97,-24.13; 4 3.81,24.13; 5 1.27,24.13; 5V@0 -11.43,-24.13; 5V@1 44.45,24.13; 5V@2 46.99,24.13; 6 -1.27,24.13; 7 -3.81,24.13; 8 -7.874,24.13; 9 -10.414,24.13; 10 -12.954,24.13; 11 -15.494,24.13; 12 -18.034,24.13; 13 -20.574,24.13; 14 19.05,24.13; 15 21.59,24.13; 16 24.13,24.13; 17 26.67,24.13; 18 29.21,24.13; 19 31.75,24.13; 20 34.29,24.13; 21 36.83,24.13; A0 1.27,-24.13; A1 3.81,-24.13; A2 6.35,-24.13; A3 8.89,-24.13; A4 11.43,-24.13; A5 13.97,-24.13; A6 16.51,-24.13; A7 19.05,-24.13; A8 24.13,-24.13; A9 26.67,-24.13; A10 29.21,-24.13; A11 31.75,-24.13; A12 34.29,-24.13; A13 36.83,-24.13; A14 39.37,-24.13; A15 41.91,-24.13; AREF -25.654,24.13; GND@0 -8.89,-24.13; GND@1 -6.35,-24.13; GND@2 44.45,-19.05; GND@3 46.99,-19.05; GND@4 -23.114,24.13; RESET -16.51,-24.13; VIN -3.81,-24.13 | drill 1.016 pad 1.88 octagon: 22 44.45,21.59; 23 46.99,21.59; 24 44.45,19.05; 25 46.99,19.05; 26 44.45,16.51; 27 46.99,16.51; 28 44.45,13.97; 29 46.99,13.97; 30 44.45,11.43; 31 46.99,11.43; 32 44.45,8.89; 33 46.99,8.89; 34 44.45,6.35; 35 46.99,6.35; 36 44.45,3.81; 37 46.99,3.81; 38 44.45,1.27; 39 46.99,1.27; 40 44.45,-1.27; 41 46.99,-1.27; 42 44.45,-3.81; 43 46.99,-3.81; 44 44.45,-6.35; 45 46.99,-6.35; 46 44.45,-8.89; 47 46.99,-8.89; 48 44.45,-11.43; 49 46.99,-11.43; 50 44.45,-13.97; 51 46.99,-13.97; 52 44.45,-16.51; 53 46.99,-16.51
CAP-PTH-SMALL-KIT = drill 1.016 pad 2.032: 1 -1.397,0; 2 1.397,0
C1206 = smd 1.6 x 1.8: 1 -1.4,0; 2 1.4,0
DO41-10 = drill 1.118: A 5.08,0; C -5.08,0
DO35-7 = drill 0.813 long: A 3.81,0; C -3.81,0
DISPLAY128X128 = drill 0.8 long: CS 20.32,-5.08; DC 20.32,0; LED 20.32,7.62; RST 20.32,-2.54; SCK 20.32,5.08; SDA 20.32,2.54 | drill 1 pad 1.778 square: GND 20.32,-7.62 | drill 1 long: VCC 20.32,-10.16
TO220V = drill 1.016 long: 1 -2.54,-2.54; 2 0,-2.54; 3 2.54,-2.54
1X03 = drill 1.016 pad 1.88: 1 0,0; 2 2.54,0; 3 5.08,0
2X5 = drill 1.016 pad 1.88: 1 0,0; 2 0,2.54; 3 2.54,0; 4 2.54,2.54; 5 5.08,0; 6 5.08,2.54; 7 7.62,0; 8 7.62,2.54; 9 10.16,0; 10 10.16,2.54
1X06 = drill 1.016 long: 1 -6.35,0; 2 -3.81,0; 3 -1.27,0; 4 1.27,0; 5 3.81,0; 6 6.35,0
LED-1206 = smd 1.2 x 1.4: A -1.5,0; C 1.5,0
RFID-RC522 = drill 1.016 long: 3V3 -8.89,0; GND -3.81,0; IRQ -1.27,0; MISO 1.27,0; MOSI 3.81,0; RST -6.35,0; SCK 6.35,0; SS 8.89,0
MOTOR-SHIELD = drill 0.8 octagon: CS 29.21,-5.08; ENA/DIAGA 29.21,-10.16; ENB/DIAGB 29.21,-2.54; GND2 29.21,5.08; GNDMOT-2 -6.35,0; GNDMOT-3 -6.35,-2.54; INA 29.21,-12.7; INB 29.21,0; OUTA-2 -6.35,-10.16; OUTA-3 -6.35,-12.7; OUTB-2 -6.35,-5.08; OUTB-3 -6.35,-7.62; PWM 29.21,-7.62; VDD 29.21,2.54; VMOT-2 -6.35,5.08; VMOT-3 -6.35,2.54; VOUT 29.21,7.62 | drill 0.8 square: GND 29.21,10.16 | drill 2.2 square: GNDMOT-1 -5.08,-1.27 | drill 2.2 octagon: INMOT1 -5.08,-6.35; INMOT2 -5.08,-11.43; VMOT-1 -5.08,3.81
R1206 = smd 1.6 x 1.803: 1 -1.422,0; 2 1.422,0
0204/7 = drill 0.813 octagon: 1 -3.81,0; 2 3.81,0
MA03-2 = drill 1.016: 1 -2.54,-1.27 | drill 1.016 octagon: 2 -2.54,1.27; 3 0,-1.27; 4 0,1.27; 5 2.54,-1.27; 6 2.54,1.27
ALPS_EC12E_SW = drill 1 square: A -2.5,-7.5; B 2.5,-7.5; C 0,-7.5; D -2.5,7; E 2.5,7 | drill 2.2 square: GND1 -6.1,0; GND2 6.1,0
STEPDOWN_D24V10F3 = drill 1.3 square: GND -2.54,-7.62 | drill 1.3 octagon: PG 5.08,-7.62; SHDN 2.54,-7.62; VIN 0,-7.62; VOUT -5.08,-7.62
BNO005 = drill 0.6 square: 3VO -3.81,-8.89; ADC 3.81,8.89; GND -1.27,-8.89; INT 1.27,8.89; PS0 -3.81,8.89; PS1 -1.27,8.89; RST 6.35,-8.89; SCL 3.81,-8.89; SDA 1.27,-8.89; VIN -6.35,-8.89
HC-05 = drill 1: 5V 3.81,-19.685; EN 6.35,-19.685; GND 1.27,-19.685; RX -3.81,-19.685; TX -1.27,-19.685 | drill 1 square: STATE -6.35,-19.685
AK500/2-H = drill 1.321 long: 1 -2.515,0; 2 2.515,0

### Placement (x,y rotation side)
B1  126.9,114.01 180 top
C1  154.84,152.11 90 top
C2  158.65,152.11 270 top
C3  166.27,79.72 180 top
C4  163.73,69.56 180 top
C5  120.55,19.77 180 bottom
C6  120.3,13.42 180 bottom
D1  158.65,147.03 0 top
D2  162.46,74.64 180 top
D3  59.21,144.87 270 top
DISPLAY1  86.26,21.3 0 top
IC1  143.16,152.11 90 top
J2  60.86,152.11 0 top
J3  51.97,18.76 90 top
JP1  123.09,53.05 270 top
JP2  91.34,53.05 270 top
JP3  34.19,88.61 180 top
LED1  114.96,133.57 180 top
LED2  69.24,101.05 90 top
LED3  166.52,117.56 0 top
LED4  144.93,64.22 270 top
LED5  170.08,135.09 270 top
LED6  31.4,76.67 180 top
LED7  92.86,151.35 180 top
LED8  32.16,151.35 90 top
LED9  161.19,152.11 270 top
LED10  161.57,63.08 180 top
M1  157.89,31.08 45.4 top
MOT_1  126.9,45.43 90 bottom
MOT_2  92.61,45.43 90 bottom
MOT_3  25.3,78.45 180 bottom
MOT_4  25.3,111.47 180 bottom
R1  123.85,133.57 0 top
R2  72.04,101.05 90 top
R3  158.65,117.56 180 top
R4  144.93,70.83 90 top
R5  168.81,141.44 180 top
R6  30.89,80.73 180 top
R7  99.47,151.35 0 top
R8  32.16,144.74 270 top
R9  159.79,156.43 0 top
R10  170.08,64.48 270 top
R11  111.66,152.11 0 top
R12  124.36,152.11 0 top
R13  93.73,103.57 270 top
R14  90.07,103.85 270 top
R15  137.06,43.14 270 top
R16  67.34,147.28 270 top
R17  64.8,147.28 270 top
SV1  50.7,45.81 90 top
SV2  62.13,55.59 90 top
SV3  50.7,55.59 90 top
SV4  61.88,45.68 90 top
SW2  131.98,23.33 0 top
U$1  166.27,74.64 90 top
U$8  27.84,42.89 90 top
U$9  31.65,140.68 270 bottom
X1  3.71,94.96 90 top
X2  3.71,84.8 90 top
X3  78.64,152.11 0 top

### Tracks (layer width: path | path; a pad name or v marks a point on that pad's centre or on a via)
3.3V  (via drill 1)  (1 unrouted)
  Top 1.27: 170.08,68.29 171.35,69.56 U$1.VOUT 173.89,59.4 172.62,58.13 166.27,58.13 149.76,41.62 149.76,30.95 147.6,28.79 | 170.08,68.29 R10.1 | 170.08,68.29 168.81,69.56 C4.1 162.59,72.1 v154.84,72.1 147.22,79.72 131.98,79.72 | M1.3V3 147.6,28.79 | DISPLAY1.LED 114.2,28.92 115.47,27.65 | 115.47,27.65 146.46,27.65 147.6,28.79 | DISPLAY1.VCC 111.66,11.14 115.47,14.95 115.47,18.76 | 115.47,18.76 115.47,27.65 | DISPLAY1.RST 115.47,18.76 | 131.98,79.72 97.69,79.72 | 97.69,79.72 95.15,77.18 MOT_2.VDD | 131.98,79.72 129.44,77.18 MOT_1.VDD | 97.69,79.72 65.94,79.72 | MOT_4.VDD 57.05,108.93 65.94,100.04 65.94,79.72 | MOT_3.VDD 62.13,75.91 65.94,79.72
  Bottom 1.27: B1.3.3V 140.87,133.82 154.84,119.85 v154.84,72.1
5V
  Top 1.27: C2.1 158.65,156.15 R9.1 151.54,156.43 149.76,154.65 IC1.3 139.6,154.65 138.33,153.38 B1.5V@0 138.33,109.18 136.81,107.66 93.73,107.66 | 90.07,107.66 93.73,107.66 | 90.07,107.66 R14.1 | 90.07,107.66 87.53,107.66 86.26,106.39 86.26,91.15 84.99,89.88 B1.5V@1 B1.5V@2 | J3.2 44.35,18.76 36.73,26.38 U$8.VIN | R13.1 93.73,107.66
  Bottom 1.27: 63.91,88.1 64.67,87.34 64.67,69.56 78.64,55.59 | 63.91,88.1 55.78,96.23 38,96.23 35.46,93.69 | 35.46,93.69 JP3.3 | U$9.5V 35.46,120.99 35.46,93.69 | 66.7,55.59 SV2.3 SV2.6 58.32,60.67 51.97,60.67 SV3.6 43.08,51.78 43.08,48.22 | 66.7,55.59 78.64,55.59 | 78.64,55.59 79.91,54.32 JP2.3 JP1.3 | U$8.VIN 43.08,42.89 43.08,48.22 | SV1.6 43.21,48.35 43.08,48.22 | SV4.6 60.61,49.75 61.37,50.51 65.18,50.51 66.7,52.03 66.7,55.59 | B1.5V@2 76.61,89.88 74.83,88.1 63.91,88.1
12V
  Bottom 2: X1.1 7.95,92.44 13.87,98.36 13.87,149.03 20.75,155.92 72.32,155.92 X3.1 79.94,155.92 104.04,155.92 R11.1 115.47,144.49 158.65,144.49 | 158.65,144.49 158.65,75.91 D2.A | D1.A 163.73,145.5 162.71,144.49 158.65,144.49
BATTERY_LEVEL
  Top 0.61: B1.A2 R12.1
  Bottom 0.61: R11.2 R12.1
DISPLAY_DC  (via drill 0.51, 0.55)
  Top 0.61: DISPLAY1.DC 100.23,21.3 93.88,14.95 44.86,14.95 32.92,26.89 v32.92,47.46 | v43.84,112.74 v57.05,112.74 | v73.56,112.74 B1.39 | v43.08,98.77 43.08,73.37 42.06,72.35 33.43,72.35 32.92,71.84 v32.92,65.75
  Bottom 0.61: v57.05,112.74 v73.56,112.74 | v43.08,98.77 43.08,111.98 v43.84,112.74 | v32.92,65.75 v32.92,47.46
DISPLAY_SS  (via drill 0.51, 0.55)
  Top 0.61: v44.35,94.7 v44.35,98.77 | v46.89,115.28 v57.05,115.28 | v77.37,126.71 v77.37,129.25 | B1.38 85.5,112.74 86.26,113.5 v86.26,132.73 | v76.61,115.28 v73.56,115.28
  Bottom 0.61: DISPLAY1.CS 105.31,16.22 102.77,13.68 44.35,13.68 30.38,27.65 30.38,72.35 32.16,74.13 43.84,74.13 44.35,74.64 v44.35,94.7 | v57.05,115.28 v73.56,115.28 | v77.37,129.25 77.37,133.06 79.15,134.84 85.5,134.84 86.26,134.07 v86.26,132.73 | v44.35,98.77 44.35,104.29 46.29,106.23 46.29,114.68 v46.89,115.28 | v77.37,126.71 77.37,115.79 76.86,115.28 v76.61,115.28
DRAIN
  Top 1.016: X3.2 81.16,154.67 79.91,155.92 67.21,155.92 J2.2
GATE  (via drill 0.51)
  Top 0.61: R16.2 67.34,141.95 v73.56,135.72 | B1.43 73.05,117.82 72.29,118.58 v72.29,132.04
  Bottom 0.61: v72.29,132.04 72.42,132.04 73.56,133.18 v73.56,135.72
GND  (via drill 0.51)
  other vias: 112.93,116.55 87.28,34.25 115.47,84.29 102.52,83.27 107.85,84.8 107.85,66.26 58.83,125.18 55.27,130.52 57.56,42.89 66.19,105.12 40.03,65.75 114.96,59.4 115.47,75.91 66.19,57.62 81.18,24.35 108.1,133.31 93.12,115.53 124.61,81.5 121.82,83.02 39.27,114.26 68.48,53.56
  pour Bottom (isolate 0.406): -4.22,-3.34 185.73,-3.34 185.73,162.52 -3.77,162.52
  pour Top (isolate 0.406): -1.52,160.24 184.08,160.24 184.08,-1.82 -1.52,-1.82
HC-05_ENABLE
  Top 0.61: U$9.EN 76.1,134.33 77.37,135.6 83.72,135.6 83.97,135.34 83.97,118.71 83.09,117.82 B1.42
HC-05_RX  (via drill 0.51, 0.55)
  Top 0.61: U$9.RX 48.16,141.31 v48.16,124.8 | v45.62,98.77 v45.62,72.1 | B1.19 v95.15,84.8 | v78.64,69.56 76.1,69.56 69.75,75.91 v68.48,75.91 | v51.97,69.56 66.7,69.56 v67.21,70.07
  Bottom 0.61: v45.62,98.77 45.62,103.85 48.16,106.39 v48.16,124.8 | v95.15,84.8 95.15,78.45 93.88,77.18 93.88,70.83 79.91,70.83 v78.64,69.56 | v68.48,75.91 67.21,74.64 v67.21,70.07 | v45.62,72.1 45.62,70.07 46.13,69.56 v51.97,69.56
HC-05_TX  (via drill 0.51, 0.55)
  Top 0.61: U$9.TX 49.43,140.04 v49.43,124.8 | v46.89,98.77 v46.89,65.75 | v47.91,61.43 78.13,61.43 79.02,62.32 99.85,62.32 v100.23,61.94 | v97.69,84.8 B1.18 | v105.31,61.94 v105.31,65.75
  Bottom 0.61: v46.89,98.77 46.89,102.58 49.43,105.12 v49.43,124.8 | v46.89,65.75 46.89,61.94 47.4,61.43 v47.91,61.43 | v100.23,61.94 101.25,60.92 104.29,60.92 v105.31,61.94 | v105.31,65.75 105.31,67.53 102.77,70.07 102.77,71.72 101.5,72.99 101.5,84.04 100.74,84.8 v97.69,84.8
LED1  (via drill 0.51)
  Top 0.61: B1.8 v134.77,100.04 | R1.2 133,133.57 134.77,131.79 v134.77,109.69
  Bottom 0.61: v134.77,100.04 v134.77,109.69
LED2
  Top 0.61: B1.33 72.8,105.12 72.04,104.36 R2.2
LED3
  Top 0.61: B1.9 137.31,101.46 139.07,103.21 149.76,103.21 149.76,116.8 150.52,117.56 R3.2
LED4  (via drill 0.51)
  Top 0.61: v144.93,77.43 R4.2
  Bottom 0.61: B1.12 v144.93,77.43
LED5  (via drill 0.51, 0.55)
  Top 0.61: R5.2 v151.79,141.44 | v146.71,134.07 146.71,113.5 139.91,106.69 v139.91,105.85 | v139.85,98.77 B1.10
  Bottom 0.61: v146.71,134.07 146.71,140.42 147.73,141.44 v151.79,141.44 | v139.91,105.85 139.91,98.82 v139.85,98.77
LED6  (via drill 0.51)
  Top 0.61: B1.35 68.73,107.66 66.96,109.44 v66.96,118.07 | v26.32,80.73 R6.2 | v58.57,122.9 v34.7,122.9
  Bottom 0.61: v66.96,118.07 66.96,121.37 65.43,122.9 v58.57,122.9 | v26.32,80.73 26.06,80.73 24.28,82.51 24.28,122.14 25.05,122.9 v34.7,122.9
LED7
  Top 0.61: B1.A7 107.85,148.81 105.31,151.35 R7.2
LED8  (via drill 0.51, 0.55)
  Top 0.61: B1.37 70.26,110.2 68.73,111.72 68.73,119.6 67.97,120.36 v62.89,120.36 | R8.2 32.16,135.85 | 32.16,135.85 32.16,122.14 33.94,120.36 v58.07,120.36 | 32.16,135.85 31.9,135.6 27.84,135.6 arc90 25.3,138.14 25.05,138.14 | 25.05,138.14 arc90 22.25,135.34 | 25.05,138.14 25.05,141.69 | 25.05,138.14 25.05,136.61 | 25.05,136.61 24.54,136.61 | 25.05,136.61 25.55,136.61
  Bottom 0.61: v58.07,120.36 v62.89,120.36
MISO  (via drill 0.51, 0.55)  (1 unrouted)
  Top 0.61: v95.15,92.42 97.18,94.45 v97.18,104.86 | v123.34,30.95 v101.5,30.95 | v147.22,34.25 v126.65,34.25 | v78.64,58.13 78.64,54.83 77.62,53.81 72.8,53.81 72.29,53.3 v72.29,51.78
  Bottom 0.61: v78.64,58.13 72.29,64.48 72.29,74.64 90.07,92.42 v95.15,92.42 | v72.29,51.78 72.29,30.95 | 72.29,30.95 72.29,26.38 69.75,23.84 59.59,23.84 54.51,18.76 J3.1 | B1.50 93.88,127.98 97.18,124.68 v97.18,104.86 | M1.MISO 156.51,34.25 v147.22,34.25 | v101.5,30.95 72.29,30.95 | v123.34,30.95 124.61,30.95 125.12,31.46 125.12,33.49 125.88,34.25 v126.65,34.25
MOSI  (via drill 0.51, 0.55)  (1 unrouted)
  Top 0.61: v109.12,51.78 v109.12,65.75 | v147.22,36.28 108.36,36.28 v107.6,37.05
  Bottom 0.61: DISPLAY1.SDA 102.77,23.84 | J3.4 45.62,21.3 44.35,20.03 44.35,17.23 44.86,16.73 57.3,16.73 59.34,18.76 95.66,18.76 100.74,23.84 102.77,23.84 | 102.77,23.84 102.77,37.81 107.6,42.63 | 107.6,42.63 109.12,44.16 v109.12,51.78 | v109.12,65.75 109.12,86.58 111.03,88.48 111.03,124.8 99.6,136.23 78.01,136.23 76.1,134.33 76.1,128.61 76.74,127.98 B1.51 | M1.MOSI 158.07,36.28 v147.22,36.28 | v107.6,37.05 107.6,42.63
MOT1_1
  Top 1.27: MOT_1.INMOT1 120.55,44.16 JP1.6
MOT1_2
  Top 1.27: JP1.5 116.99,49.24 115.47,47.71 MOT_1.INMOT2
MOT1_ENC_A  (via drill 0.51, 0.55)
  Top 0.61: v77.37,68.29 76.1,68.29 69.75,74.64 52.61,74.64 v52.61,98.77 | v100.48,144.49 v81.43,144.49
  Bottom 0.61: JP1.2 120.55,56.86 114.2,63.21 104.04,63.21 98.96,68.29 v77.37,68.29 | v52.61,98.77 52.61,127.34 53.24,127.98 60.23,127.98 76.74,144.49 v81.43,144.49 | B1.A8 102.77,143.98 102.26,144.49 v100.48,144.49
MOT1_ENC_B  (via drill 0.51, 0.55)
  Top 0.61: v71.02,78.07 71.02,75.91 76.1,70.83 v96.17,70.83 | v74.83,91.4 74.83,87.28 76.04,86.07 v78.64,86.07 | B1.A9 100.23,140.68 98.96,141.95 v81.43,141.95 | v74.83,98.77 v74.83,101.31
  Bottom 0.61: JP1.1 118.01,64.48 104.29,64.48 101.25,67.53 101.25,70.07 100.48,70.83 v96.17,70.83 | v78.64,86.07 78.64,85.69 v71.02,78.07 | v74.83,91.4 v74.83,98.77 | v74.83,101.31 74.83,136.87 79.91,141.95 v81.43,141.95
MOT1_INA  (via drill 0.51, 0.55)
  Top 0.61: v106.58,104.86 108.1,106.39 112.68,106.39 122.84,96.23 131.98,96.23 132.74,95.47 132.74,87.34 132.11,86.7 v124.36,86.7 | v113.41,86.7 v121.82,86.7 | v84.74,96.61 84.74,92.93 84.23,92.42 B1.22
  Bottom 0.61: MOT_1.INA 111.66,77.18 111.66,84.8 113.41,86.55 v113.41,86.7 | v106.58,104.86 106.58,98.77 104.42,96.61 v84.74,96.61 | v121.82,86.7 v124.36,86.7
MOT1_INB  (via drill 0.51)
  Top 0.61: B1.23 77.37,92.42 76.1,91.15 76.1,87.34 79.91,87.34 82.53,84.71 v88.88,84.71 | v104.04,70.83 v124.36,70.83
  Bottom 0.61: v104.04,70.83 104.04,83.53 101.5,86.07 90.24,86.07 v88.88,84.71 | MOT_1.INB 126.9,73.37 v124.36,70.83
MOT1_PWM  (via drill 0.51)
  Top 0.61: v119.28,84.8 v121.82,84.8
  Bottom 0.61: v119.28,84.8 118.01,86.07 B1.2 | MOT_1.PWM 120.55,75.91 125.38,75.91 126.14,76.67 126.14,84.29 125.63,84.8 v121.82,84.8
MOT2_1
  Top 1.27: MOT_2.INMOT1 86.26,45.68 87.28,46.7 JP2.6
MOT2_2
  Top 1.27: JP2.5 86.51,49.24 81.18,43.9 MOT_2.INMOT2
MOT2_ENC_A  (via drill 0.51, 0.55)
  Top 0.61: v152.3,96.23 154.84,93.69 154.84,87.85 v152.3,85.31 | v100.23,51.78 95.15,56.86 JP2.2 | v101.5,32.73 v142.14,32.73
  Bottom 0.61: B1.A10 97.69,144.49 98.96,145.76 110.92,145.76 114.73,141.95 126.9,141.95 128.17,140.68 128.17,97.5 129.44,96.23 v152.3,96.23 | v101.5,32.73 100.23,34 v100.23,51.78 | v142.14,32.73 143.16,32.73 144.68,34.25 144.68,45.43 146.46,47.21 151.54,47.21 152.3,47.97 v152.3,85.31
MOT2_ENC_B  (via drill 0.51, 0.55)
  Top 0.61: v50.96,98.77 50.89,98.77 50.89,73.18 51.97,72.1 69.75,72.1 74.83,67.02 v77.37,67.02 | B1.A11 95.15,139.41 93.88,140.68 76.1,140.68 73.56,143.22 v68.48,143.22 | v54.51,133.06 50.95,129.5 v50.95,124.8
  Bottom 0.61: JP2.1 91.34,63.21 87.53,67.02 v77.37,67.02 | v50.96,98.77 v50.96,124.8 v50.95,124.8 | v68.48,143.22 58.32,133.06 v54.51,133.06
MOT2_INA  (via drill 0.51)
  Top 0.61: v84.48,88.48 86.9,86.07 90.07,86.07 v91.34,84.8
  Bottom 0.61: B1.24 83.72,94.96 84.48,94.2 v84.48,88.48 | MOT_2.INA 82.45,77.18 91.34,77.18 92.61,78.45 92.61,83.53 v91.34,84.8
MOT2_INB  (via drill 0.51)
  Top 0.61: v78.64,72.1 73.56,77.18 v73.56,78.07 | v79.91,84.8 75.59,84.8 73.56,86.83 73.56,93.69 74.83,94.96 B1.25
  Bottom 0.61: MOT_2.INB 90.07,72.1 v78.64,72.1 | v79.91,84.8 79.91,84.42 v73.56,78.07
MOT2_PWM  (via drill 0.51)
  Top 0.61: MOT_2.PWM 84.99,73.37 86.26,72.1 103.41,72.1 108.36,77.05 v119.53,77.05
  Bottom 0.61: v119.53,77.05 119.66,77.05 120.55,77.94 B1.3
MOT3_1
  Top 1.27: JP3.6 27.84,85.81 26.82,84.8 MOT_3.INMOT1
MOT3_2
  Top 1.27: MOT_3.INMOT2 22.51,92.16 29.11,92.16 30.38,90.89 JP3.5
MOT3_ENC_A  (via drill 0.55)
  Top 0.61: JP3.2 v38,98.77
  Bottom 0.61: v38,98.77 38,120.36 49.43,131.79 59.59,131.79 74.83,147.03 90.07,147.03 92.61,144.49 B1.A12
MOT3_ENC_B  (via drill 0.55)
  Top 0.61: JP3.1 v40.54,98.77
  Bottom 0.61: v40.54,98.77 40.54,119.09 50.7,129.25 59.59,129.25 76.1,145.76 87.53,145.76 90.07,143.22 B1.A13
MOT3_INA  (via drill 0.51, 0.55)
  Top 0.61: MOT_3.INA 55.78,91.15 58.32,88.61 58.32,82.26 61.37,82.26 62.13,83.02 62.13,93.18 62.64,93.69 v63.4,93.69 | v71.02,91.4 71.02,84.8 73.56,82.26 109.12,82.26 110.01,83.15 110.01,97.88 103.53,104.36 v103.53,104.79 | B1.26 83.72,97.5 84.99,98.77 84.99,107.66 86.84,109.51 v103.53,109.51
  Bottom 0.61: v103.53,109.51 v103.53,104.79 | v71.02,91.4 71.02,93.43 70.77,93.69 v63.4,93.69
MOT3_INB  (via drill 0.51, 0.55)
  Top 0.61: v64.54,91.15 64.54,80.86 62.13,78.45 MOT_3.INB | v67.46,91.15 73.81,97.5 B1.27
  Bottom 0.61: v64.54,91.15 v67.46,91.15
MOT3_PWM  (via drill 0.51, 0.55)
  Top 0.61: MOT_3.PWM 55.78,86.07 57.05,84.8 57.05,81.75 57.56,81.24 62.38,81.24 63.4,82.26 v63.4,92.42 | v69.75,91.4 69.75,83.53 72.29,80.99 121.82,80.99 123.09,82.26 B1.4
  Bottom 0.61: v69.75,91.4 69.75,92.16 69.5,92.42 v63.4,92.42
MOT4_INA  (via drill 0.51, 0.55)
  Top 0.61: v105.31,122.9 105.31,142.46 104.55,143.22 v80.16,143.22
  Bottom 0.61: v105.31,122.9 105.31,101.31 104.04,100.04 B1.28 | MOT_4.INA 54.51,125.44 55.78,126.71 62.38,126.71 78.89,143.22 v80.16,143.22
MOT4_INB
  Bottom 0.61: MOT_4.INB 62.13,111.47 73.56,100.04 B1.29
MOT4_PWM  (via drill 0.51)
  Top 0.61: v67.46,96.23 67.46,101.05 58.32,110.2 58.32,116.55 55.78,119.09 MOT_4.PWM | v72.42,91.4 72.42,85.94 74.83,83.53 v96.67,83.53 | v98.71,78.19 98.83,78.07 v127.79,78.07
  Bottom 0.61: v96.67,83.53 97.94,83.53 98.45,83.02 98.45,78.45 v98.71,78.19 | v72.42,91.4 72.42,94.45 72.16,94.7 67.72,94.7 67.46,94.96 v67.46,96.23 | v127.79,78.07 127.79,86.7 127.41,87.08 126.39,87.08 125.63,87.85 B1.5
N$3
  Top 1.27: LED9.A 161.19,156.4 R9.2
N$4
  Bottom 2: U$1.VIN D2.C 167.67,74.76 C3.1
N$5
  Top 0.61: R17.1 62.54,148.7 | 62.54,148.7 D3.C | J2.1 60.86,150.38 62.54,148.7
N$6
  Top 0.61: R10.2 163.1,63.06 LED10.A
N$7  (via drill 0.51)
  Top 0.61: v69.37,148.68 67.36,148.68 R16.1
  Bottom 0.61: D3.A 59.21,145.8 59.93,146.52 68.48,146.52 69.37,147.41 v69.37,148.68
N$8
  Bottom 1.27: IC1.1 153.7,149.57 | 153.7,149.57 C1.1 | D1.C 153.57,149.44 153.7,149.57
N$10
  Top 0.61: R1.1 LED1.A
N$12
  Top 0.61: R2.1 69.32,99.63 LED2.A
N$13
  Top 0.61: R3.1 LED3.A
N$14
  Top 0.61: R4.1 LED4.A
N$17
  Top 0.61: R5.1 170.23,136.74 LED5.A
N$18
  Top 0.61: R6.1 34.7,80.73 35.21,80.23 35.21,77.18 34.7,76.67 LED6.A
N$23
  Top 0.61: LED7.A R7.1
N$24
  Top 0.61: LED8.A R8.1
N$25  (via drill 0.55)
  Top 0.61: v137.06,38.57 R15.2
  Bottom 0.61: v137.06,38.57 137.06,32.91 SW2.E
NFC_IRQ  (via drill 0.51, 0.55)  (1 unrouted)
  Top 0.61: B1.14 107.85,91.91 107.34,92.42 101.75,92.42 100.48,93.69 v100.48,104.86 | M1.IRQ 156.62,30.55 v156.62,38.82 | v152.05,98.01 153.57,98.01 156.11,95.47 156.11,85.81 v150.78,80.48 | v101.25,111.72 v132.49,111.72 | v147.47,53.05 v147.47,45.17
  Bottom 0.61: v152.05,98.01 148.24,98.01 146.71,99.53 146.71,110.71 145.7,111.72 v132.49,111.72 | v150.78,80.48 147.47,77.18 v147.47,53.05 | v101.25,111.72 100.48,110.96 v100.48,104.86 | v147.47,45.17 147.47,42.13 148.74,40.86 155.86,40.86 156.62,40.09 v156.62,38.82
NFC_SS  (via drill 0.55)  (1 unrouted)
  Top 0.61: v160.68,59.65 v144.93,59.65
  Bottom 0.61: M1.SS 164.13,56.71 161.19,59.65 v160.68,59.65 | v144.93,59.65 143.16,59.65 142.39,60.41 B1.11
PIXY_SS  (via drill 0.51, 0.55)
  Top 0.61: v69.75,51.78 v69.75,58.13 | v60.86,87.34 v60.86,101.31 | v73.56,130.52 B1.53 | v60.86,109.44 60.86,122.9 v63.4,125.44
  Bottom 0.61: J3.7 65.94,26.38 69.75,30.19 v69.75,51.78 | v69.75,58.13 60.86,67.02 v60.86,87.34 | v60.86,101.31 v60.86,109.44 | v63.4,125.44 68.48,130.52 v73.56,130.52
R_ENC_A  (via drill 0.51)
  Top 0.61: v112.68,120.61 89.31,120.61 87.53,122.39 B1.A14
  Bottom 0.61: v112.68,120.61 114.71,120.61 115.47,119.85 115.47,95.47 117.25,93.69 131.73,93.69 132.74,92.67 132.74,87.34 arc90 135.79,84.29 137.31,84.29 arc-90 139.85,81.75 139.85,30.44 129.48,20.07 | SW2.A 129.48,20.07 | 129.48,20.07 129.19,19.77 C5.2
R_ENC_B  (via drill 0.51, 0.55)
  Top 0.61: v110.39,51.78 v110.39,65.75 | B1.A15 85.12,138.01 v85.12,129.25 | v111.03,86.7 111.03,102.2 v108.36,104.86 | v121.82,17.23 v121.82,23.58
  Bottom 0.61: v110.39,51.78 110.39,35.27 111.66,34 118.01,34 121.82,30.19 v121.82,23.58 | v108.36,104.86 108.36,122.39 101.5,129.25 v85.12,129.25 | v111.03,86.7 110.39,86.07 v110.39,65.75 | SW2.B 132.07,13.42 121.94,13.42 121.82,13.55 | C6.2 121.82,13.55 | 121.82,13.55 v121.82,17.23
R_SEL  (via drill 0.51)
  Top 0.61: R15.1 137.06,60.67 125.63,72.1 v105.31,72.1 | v87.78,105.12 87.78,88.35 88.8,87.34 v93.88,87.34
  Bottom 0.61: v105.31,72.1 105.31,84.8 102.77,87.34 v93.88,87.34 | B1.40 86.51,115.28 87.78,114.01 v87.78,105.12
RESET  (via drill 0.55)  (1 unrouted)
  Top 0.61: v155.35,43.65 152.81,41.11 152.81,27.18 M1.RST | v161.7,131.28 161.7,137.38 160.94,138.14 B1.RESET
  Bottom 0.61: v161.7,131.28 161.7,73.62 155.35,67.27 v155.35,43.65
SCK  (via drill 0.51, 0.55)  (1 unrouted)
  Top 0.61: DISPLAY1.SCK 100.23,26.38 | 100.23,26.38 95.15,21.3 J3.3 | 100.23,26.38 100.23,39.08 105.06,43.9 | v106.58,65.75 106.58,45.43 105.06,43.9 | M1.SCK 159.41,38.53 v159.41,46.44 | v157.38,54.83 v138.58,54.83 | v112.68,43.9 105.06,43.9
  Bottom 0.61: v106.58,65.75 106.58,85.56 109.76,88.73 109.76,123.53 102.77,130.52 B1.52 | v159.41,46.44 159.41,54.02 158.6,54.83 v157.38,54.83 | v138.58,54.83 135.03,54.83 133,52.79 133,45.43 131.47,43.9 v112.68,43.9
SCL  (via drill 0.51)
  Top 0.61: R14.2 B1.21 | SV3.2 49.43,51.78 50.7,50.51 59.59,50.51 | SV2.2 60.86,51.78 59.59,50.51 | U$8.SCL 35.46,46.7 34.19,45.43 34.19,41.62 35.46,40.35 49.43,40.35 | J3.5 54.51,23.84 55.02,24.35 55.02,37.81 | SV1.2 49.43,40.35 | 49.43,40.35 52.73,40.35 55.02,38.06 55.02,37.81 | 60.61,40.35 74.58,40.35 81.69,47.46 81.69,50.51 | 81.69,50.51 v81.69,57.62 | 59.59,50.51 67.21,50.51 | 67.21,50.51 81.69,50.51 | SV4.3 66.19,45.68 67.21,46.7 67.21,50.51 | SV4.2 60.61,40.35 | 60.61,40.35 57.56,40.35 55.02,37.81
  Bottom 0.61: B1.21 74.83,74.64 74.83,64.48 v81.69,57.62
SDA  (via drill 0.51)
  Top 0.61: R13.2 93.73,91 B1.20 | U$8.SDA 39.27,44.16 40.54,45.43 | 40.54,45.43 40.54,54.32 41.81,55.59 SV3.4 SV3.3 55.78,55.59 | 55.78,55.59 SV2.4 | 55.78,55.59 60.23,60.03 80.55,60.03 v81.18,60.67 | 40.54,45.43 41.81,44.16 v46.89,44.16
  Bottom 0.61: B1.20 76.1,73.37 76.1,65.75 v81.18,60.67 | SV1.4 47.53,45.81 46.89,45.17 v46.89,44.16 46.89,41.11 | 46.89,41.11 46.89,37.55 51.97,32.47 J3.9 | SV4.4 56.54,45.68 55.78,44.92 55.78,43.4 53.49,41.11 46.89,41.11
VMOT
  Top 2: 48.92,63.21 76.1,63.21 81.18,68.29 102.77,68.29 | 102.77,68.29 124.36,68.29 130.71,61.94 MOT_1.VMOT-1 | MOT_4.VMOT-1 44.35,107.66 48.92,103.09 48.92,63.21 | MOT_2.VMOT-1 102.77,46.7 102.77,68.29 | 48.92,63.21 43.59,63.21 41.18,63.2 arc43 32.97,59.9 | 32.97,59.9 arc-137 14.32,68.6 14.32,78.57 arc52 7.27,82.2 X2.1 | 32.97,59.9 29.44,63.83 arc-55 27.61,70.87 arc91 23.83,74.66 MOT_3.VMOT-1

### Text on the board
tNames: Created by / Ribaldi Valerio
200bmp: C:/Users/Valerio/Desktop/Soccer-2018-19/Elettronica/Immagini/bmp/nero prova.bmp